# Altium schematic sheet fiber.SCHDOC
size B
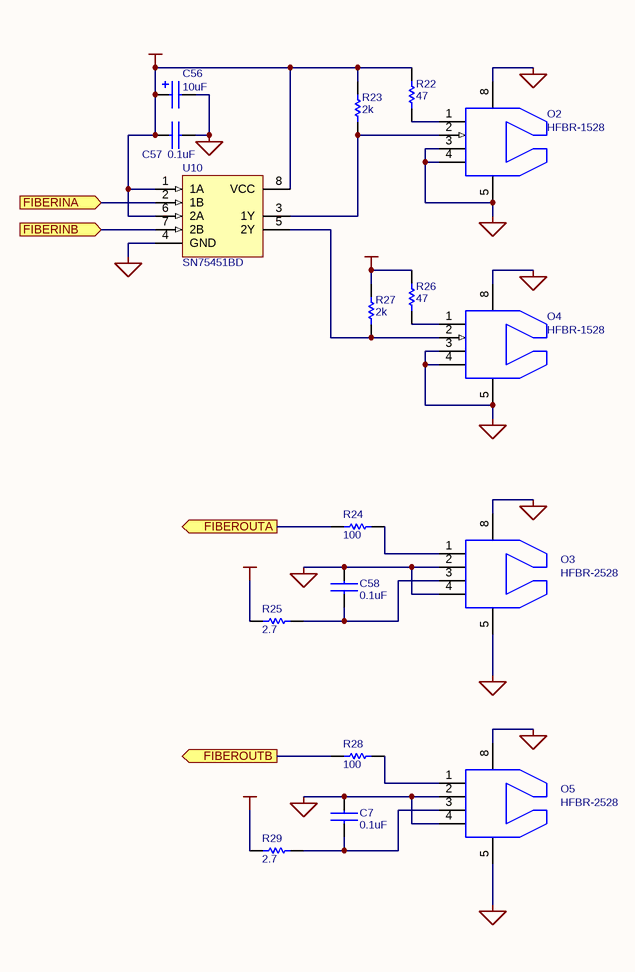
[diagram p0: fiber.SCHDOC]

## Parts
C7  value 0.1uF  [0603]  (hidden comment: CAPACITOR)
C56  value 10uF  [3216]  (hidden comment: Bypass Cap)
C57  value 0.1uF  [0603]  (hidden comment: CAPACITOR)
C58  value 0.1uF  [0603]  (hidden comment: CAPACITOR)
O2  HFBR-1528  [HPVL]
O3  HFBR-2528  [HPVL]
O4  HFBR-1528  [HPVL]
O5  HFBR-2528  [HPVL]
R22  value 47  [0603]  (hidden comment: RESISTOR)
R23  value 2k  [0603]  (hidden comment: RESISTOR)
R24  value 100  [0603]  (hidden comment: RESISTOR)
R25  value 2.7  [0603]  (hidden comment: RESISTOR)
R26  value 47  [0603]  (hidden comment: RESISTOR)
R27  value 2k  [0603]  (hidden comment: RESISTOR)
R28  value 100  [0603]  (hidden comment: RESISTOR)
R29  value 2.7  [0603]  (hidden comment: RESISTOR)
U10  SN75451BD  [SO-G8/E2.5]

## Ports
FIBERINA (in), FIBERINB (in), FIBEROUTA (out), FIBEROUTB (out)

## Nets
+5VCC: C56.1 C57.1 R22.2 R23.2 R25.1 R26.2 R27.2 R29.1 U10.1(1A) U10.6(2A) U10.8(VCC)
GND: C7.2 C56.2 C57.2 C58.2 O2.3 O2.4 O2.5 O2.8 O3.2 O3.4 O3.5 O3.8 O4.3 O4.4 O4.5 O4.8 O5.2 O5.4 O5.5 O5.8 U10.4(GND)
FIBERINA: U10.2(1B) ; port FIBERINA
FIBERINB: U10.7(2B) ; port FIBERINB
FIBEROUTA: R24.1 ; port FIBEROUTA
FIBEROUTB: R28.1 ; port FIBEROUTB
NetC7_1: C7.1 O5.3 R29.2
NetC58_1: C58.1 O3.3 R25.2
NetO2_1: O2.1 R22.1
NetO2_2: O2.2 R23.1 U10.3(1Y)
NetO3_1: O3.1 R24.2
NetO4_1: O4.1 R26.1
NetO4_2: O4.2 R27.1 U10.5(2Y)
NetO5_1: O5.1 R28.2

## Notes on the sheet
- Title:
- Engineer:
- Date:
- Revision:
- Sheet
- of
- File:

## Library data of the parts
C7 C57 C58 = CAPACITOR: Standard Capacitor
C56 = POLCAP: Standard Capacitor
O2 O4 = HFBR-1528: Low-cost fiber transmitter
O3 O5 = HFBR-2528: Low-cost fiber receiver
R22-R29 = RESISTOR: Standard Passive Resistor
U10 = SN75451BD: Dual Peripheral Driver; Manufacturer: Texas Instruments; Package Information: Latest Revision: Jan-1998; Class I: Interface; Published: 15-May-2002; Datasheet: 1991 Interface Circuits Data Book (May-1990); Package Reference: D008; Publisher: Altium Limited; Class II: Peripheral Driver